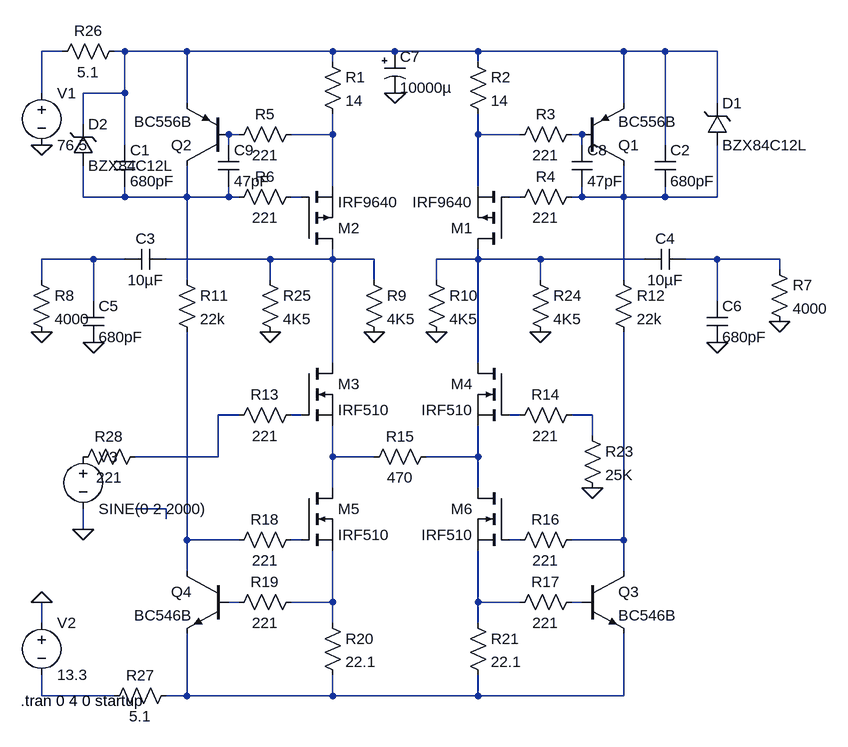
[diagram p0: schematic BOSOZ.asc]
BOSOZ.asc, the LTspice schematic file:
Version 4
SHEET 1 884 896
WIRE -320 -144 -352 -144
WIRE -224 -144 -240 -144
WIRE -128 -144 -224 -144
WIRE 96 -144 -128 -144
WIRE 192 -144 96 -144
WIRE 320 -144 192 -144
WIRE 544 -144 320 -144
WIRE 608 -144 544 -144
WIRE 688 -144 608 -144
WIRE 96 -128 96 -144
WIRE 320 -128 320 -144
WIRE -352 -80 -352 -144
WIRE -224 -80 -224 -144
WIRE -224 -80 -288 -80
WIRE -128 -64 -128 -144
WIRE 544 -64 544 -144
WIRE 688 -64 688 -144
WIRE -288 -32 -288 -80
WIRE -48 -16 -64 -16
WIRE 96 -16 96 -48
WIRE 96 -16 32 -16
WIRE 320 -16 320 -48
WIRE 384 -16 320 -16
WIRE 480 -16 464 -16
WIRE -224 0 -224 -80
WIRE -64 0 -64 -16
WIRE 480 0 480 -16
WIRE 608 0 608 -144
WIRE 96 64 96 -16
WIRE 320 64 320 -16
WIRE -288 80 -288 32
WIRE -224 80 -224 64
WIRE -224 80 -288 80
WIRE -128 80 -128 32
WIRE -128 80 -224 80
WIRE -64 80 -64 64
WIRE -64 80 -128 80
WIRE -48 80 -64 80
WIRE 48 80 32 80
WIRE 384 80 368 80
WIRE 480 80 480 64
WIRE 480 80 464 80
WIRE 544 80 544 32
WIRE 544 80 480 80
WIRE 608 80 608 64
WIRE 608 80 544 80
WIRE 688 80 688 0
WIRE 688 80 608 80
WIRE -272 176 -352 176
WIRE -224 176 -272 176
WIRE 0 176 -160 176
WIRE 96 176 96 160
WIRE 96 176 0 176
WIRE 160 176 96 176
WIRE 320 176 320 160
WIRE 320 176 256 176
WIRE 416 176 320 176
WIRE 576 176 416 176
WIRE 688 176 640 176
WIRE 784 176 688 176
WIRE 784 192 784 176
WIRE -352 208 -352 176
WIRE -128 208 -128 80
WIRE 0 208 0 176
WIRE 160 208 160 176
WIRE 256 208 256 176
WIRE 416 208 416 176
WIRE 544 208 544 80
WIRE -272 240 -272 176
WIRE 688 240 688 176
WIRE 96 336 96 176
WIRE 320 336 320 176
WIRE -48 416 -80 416
WIRE 48 416 32 416
WIRE 384 416 368 416
WIRE 496 416 464 416
WIRE 496 448 496 416
WIRE -80 480 -80 416
WIRE -80 480 -208 480
WIRE 96 480 96 432
WIRE 160 480 96 480
WIRE 320 480 320 432
WIRE 320 480 240 480
WIRE 96 528 96 480
WIRE 320 528 320 480
WIRE -160 560 -208 560
WIRE -160 576 -160 560
WIRE -288 592 -288 560
WIRE -128 608 -128 288
WIRE -48 608 -128 608
WIRE 48 608 32 608
WIRE 384 608 368 608
WIRE 544 608 544 288
WIRE 544 608 464 608
WIRE -128 656 -128 608
WIRE 544 656 544 608
WIRE -48 704 -64 704
WIRE 96 704 96 624
WIRE 96 704 32 704
WIRE 320 704 320 624
WIRE 384 704 320 704
WIRE 480 704 464 704
WIRE -352 736 -352 704
WIRE 96 736 96 704
WIRE 320 736 320 704
WIRE -352 848 -352 816
WIRE -240 848 -352 848
WIRE -128 848 -128 752
WIRE -128 848 -160 848
WIRE 96 848 96 816
WIRE 96 848 -128 848
WIRE 320 848 320 816
WIRE 320 848 96 848
WIRE 544 848 544 752
WIRE 544 848 320 848
FLAG 160 288 0
FLAG 256 288 0
FLAG 496 528 0
FLAG -272 304 0
FLAG 688 304 0
FLAG -352 0 0
FLAG -352 704 0
FLAG 784 272 0
FLAG -352 288 0
FLAG 0 288 0
FLAG 416 288 0
FLAG 192 -80 0
FLAG -288 592 0
SYMBOL pmos 368 160 R180
SYMATTR InstName M1
SYMATTR Value IRF9640
SYMBOL pmos 48 160 M180
SYMATTR InstName M2
SYMATTR Value IRF9640
SYMBOL res 80 -144 R0
SYMATTR InstName R1
SYMATTR Value 14
SYMBOL res 304 -144 R0
SYMATTR InstName R2
SYMATTR Value 14
SYMBOL res 480 -32 R90
WINDOW 0 0 56 VBottom 2
WINDOW 3 32 56 VTop 2
SYMATTR InstName R3
SYMATTR Value 221
SYMBOL res 480 64 R90
WINDOW 0 0 56 VBottom 2
WINDOW 3 32 56 VTop 2
SYMATTR InstName R4
SYMATTR Value 221
SYMBOL res 48 -32 R90
WINDOW 0 0 56 VBottom 2
WINDOW 3 32 56 VTop 2
SYMATTR InstName R5
SYMATTR Value 221
SYMBOL res 48 64 R90
WINDOW 0 0 56 VBottom 2
WINDOW 3 32 56 VTop 2
SYMATTR InstName R6
SYMATTR Value 221
SYMBOL pnp 480 32 M180
SYMATTR InstName Q1
SYMATTR Value BC556B
SYMBOL pnp -64 32 R180
SYMATTR InstName Q2
SYMATTR Value BC556B
SYMBOL cap -240 0 R0
SYMATTR InstName C1
SYMATTR Value 680pF
SYMATTR SpiceLine V=25 Irms=7.25 Rser=0.004 Lser=0
SYMBOL cap 592 0 R0
SYMATTR InstName C2
SYMATTR Value 680pF
SYMATTR SpiceLine V=25 Irms=7.25 Rser=0.004 Lser=0
SYMBOL res -144 192 R0
SYMATTR InstName R11
SYMATTR Value 22k
SYMBOL res 528 192 R0
SYMATTR InstName R12
SYMATTR Value 22k
SYMBOL cap -160 160 R90
WINDOW 0 0 32 VBottom 2
WINDOW 3 32 32 VTop 2
SYMATTR InstName C3
SYMATTR Value 10µF
SYMATTR SpiceLine V=25 Irms=7.25 Rser=0.004 Lser=0
SYMBOL cap 640 160 R90
WINDOW 0 0 32 VBottom 2
WINDOW 3 32 32 VTop 2
SYMATTR InstName C4
SYMATTR Value 10µF
SYMATTR SpiceLine V=25 Irms=7.25 Rser=0.004 Lser=0
SYMBOL nmos 48 336 R0
SYMATTR InstName M3
SYMATTR Value IRF510
SYMBOL nmos 368 336 M0
SYMATTR InstName M4
SYMATTR Value IRF510
SYMBOL res 48 400 R90
WINDOW 0 0 56 VBottom 2
WINDOW 3 32 56 VTop 2
SYMATTR InstName R13
SYMATTR Value 221
SYMBOL res 480 400 R90
WINDOW 0 0 56 VBottom 2
WINDOW 3 32 56 VTop 2
SYMATTR InstName R14
SYMATTR Value 221
SYMBOL res 256 464 R90
WINDOW 0 0 56 VBottom 2
WINDOW 3 32 56 VTop 2
SYMATTR InstName R15
SYMATTR Value 470
SYMATTR SpiceLine tol=1 pwr=0.1
SYMBOL nmos 48 528 R0
SYMATTR InstName M5
SYMATTR Value IRF510
SYMBOL nmos 368 528 M0
SYMATTR InstName M6
SYMATTR Value IRF510
SYMBOL res 480 592 R90
WINDOW 0 0 56 VBottom 2
WINDOW 3 32 56 VTop 2
SYMATTR InstName R16
SYMATTR Value 221
SYMBOL res 480 688 R90
WINDOW 0 0 56 VBottom 2
WINDOW 3 32 56 VTop 2
SYMATTR InstName R17
SYMATTR Value 221
SYMBOL res 48 592 R90
WINDOW 0 0 56 VBottom 2
WINDOW 3 32 56 VTop 2
SYMATTR InstName R18
SYMATTR Value 221
SYMBOL res 48 688 R90
WINDOW 0 0 56 VBottom 2
WINDOW 3 32 56 VTop 2
SYMATTR InstName R19
SYMATTR Value 221
SYMBOL npn 480 656 R0
SYMATTR InstName Q3
SYMATTR Value BC546B
SYMBOL npn -64 656 M0
SYMATTR InstName Q4
SYMATTR Value BC546B
SYMBOL res 80 720 R0
SYMATTR InstName R20
SYMATTR Value 22.1
SYMBOL res 304 720 R0
SYMATTR InstName R21
SYMATTR Value 22.1
SYMBOL res 480 432 R0
SYMATTR InstName R23
SYMATTR Value 25K
SYMBOL cap -288 240 R0
SYMATTR InstName C5
SYMATTR Value 680pF
SYMATTR SpiceLine V=25 Irms=7.25 Rser=0.004 Lser=0
SYMBOL cap 672 240 R0
SYMATTR InstName C6
SYMATTR Value 680pF
SYMATTR SpiceLine V=25 Irms=7.25 Rser=0.004 Lser=0
SYMBOL voltage -352 -96 R0
WINDOW 123 0 0 Left 2
WINDOW 39 0 0 Left 2
SYMATTR InstName V1
SYMATTR Value 76.5
SYMBOL voltage -352 720 R0
WINDOW 123 0 0 Left 2
WINDOW 39 0 0 Left 2
SYMATTR InstName V2
SYMATTR Value 13.3
SYMBOL res 768 176 R0
SYMATTR InstName R7
SYMATTR Value 4000
SYMBOL res -368 192 R0
SYMATTR InstName R8
SYMATTR Value 4000
SYMBOL res -16 192 R0
SYMATTR InstName R25
SYMATTR Value 4K5
SYMBOL res 144 192 R0
SYMATTR InstName R9
SYMATTR Value 4K5
SYMBOL res 240 192 R0
SYMATTR InstName R10
SYMATTR Value 4K5
SYMBOL res 400 192 R0
SYMATTR InstName R24
SYMATTR Value 4K5
SYMBOL res -224 -160 R90
WINDOW 0 0 56 VBottom 2
WINDOW 3 32 56 VTop 2
SYMATTR InstName R26
SYMATTR Value 5.1
SYMBOL res -144 832 R90
WINDOW 0 0 56 VBottom 2
WINDOW 3 32 56 VTop 2
SYMATTR InstName R27
SYMATTR Value 5.1
SYMBOL zener 672 0 M180
WINDOW 0 24 64 Left 2
WINDOW 3 24 0 Left 2
SYMATTR InstName D1
SYMATTR Value BZX84C12L
SYMBOL zener -304 32 M180
WINDOW 0 24 64 Left 2
WINDOW 3 24 0 Left 2
SYMATTR InstName D2
SYMATTR Value BZX84C12L
SYMBOL polcap 176 -144 R0
WINDOW 3 24 56 Left 2
SYMATTR Value 10000µ
SYMATTR InstName C7
SYMATTR Description Capacitor
SYMATTR Type cap
SYMATTR SpiceLine V=80 Irms=0 Rser=4 Lser=0
SYMBOL cap 464 0 R0
SYMATTR InstName C8
SYMATTR Value 47pF
SYMATTR SpiceLine V=25 Irms=7.25 Rser=0.004 Lser=0
SYMBOL cap -80 0 R0
SYMATTR InstName C9
SYMATTR Value 47pF
SYMATTR SpiceLine V=25 Irms=7.25 Rser=0.004 Lser=0
SYMBOL voltage -288 464 R0
WINDOW 123 0 0 Left 2
WINDOW 39 0 0 Left 2
SYMATTR InstName V3
SYMATTR Value SINE(0 2 2000)
SYMBOL res -192 464 R90
WINDOW 0 0 56 VBottom 2
WINDOW 3 32 56 VTop 2
SYMATTR InstName R28
SYMATTR Value 221
TEXT -384 856 Left 2 !.tran 0 4 0 startup

The netlist it stands for:
* BOSOZ.asc
M1 N013 N009 N005 N005 IRF9640
M2 N012 N008 N004 N004 IRF9640
R1 N002 N004 14
R2 N002 N005 14
R3 N006 N005 221
R4 N010 N009 221
R5 N004 N003 221
R6 N008 N007 221
Q1 N010 N006 N002 0 BC556B
Q2 N007 N003 N002 0 BC556B
C1 N002 N007 680pF V=25 Irms=7.25 Rser=0.004 Lser=0
C2 N002 N010 680pF V=25 Irms=7.25 Rser=0.004 Lser=0
R11 N007 N022 22k
R12 N010 N025 22k
C3 N012 N011 10µF V=25 Irms=7.25 Rser=0.004 Lser=0
C4 N014 N013 10µF V=25 Irms=7.25 Rser=0.004 Lser=0
M3 N012 N016 N019 N019 IRF510
M4 N013 N017 N020 N020 IRF510
R13 N016 N015 221
R14 N018 N017 221
R15 N020 N019 470 tol=1 pwr=0.1
M5 N019 N023 N027 N027 IRF510
M6 N020 N024 N028 N028 IRF510
R16 N025 N024 221
R17 N029 N028 221
R18 N023 N022 221
R19 N027 N026 221
Q3 N025 N029 N031 0 BC546B
Q4 N022 N026 N031 0 BC546B
R20 N027 N031 22.1
R21 N028 N031 22.1
R23 N018 0 25K
C5 N011 0 680pF V=25 Irms=7.25 Rser=0.004 Lser=0
C6 N014 0 680pF V=25 Irms=7.25 Rser=0.004 Lser=0
V1 N001 0 76.5
V2 0 N030 13.3
R7 N014 0 4000
R8 N011 0 4000
R25 N012 0 4K5
R9 N012 0 4K5
R10 N013 0 4K5
R24 N013 0 4K5
R26 N002 N001 5.1
R27 N031 N030 5.1
D1 N010 N002 BZX84C12L
D2 N007 N002 BZX84C12L
C7 N002 0 10000µ V=80 Irms=0 Rser=4 Lser=0
C8 N006 N010 47pF V=25 Irms=7.25 Rser=0.004 Lser=0
C9 N003 N007 47pF V=25 Irms=7.25 Rser=0.004 Lser=0
V3 P001 0 SINE(0 2 2000)
R28 N015 P001 221
.model D D
.lib standard.dio
.model NPN NPN
.model PNP PNP
.lib standard.bjt
.model NMOS NMOS
.model PMOS PMOS
.lib standard.mos
.tran 0 4 0 startup
.backanno
.end